# Altium schematic sheet Main_2.SchDoc
size 379 x 180 mm; SheetNumber: 5; SheetTotal: 12
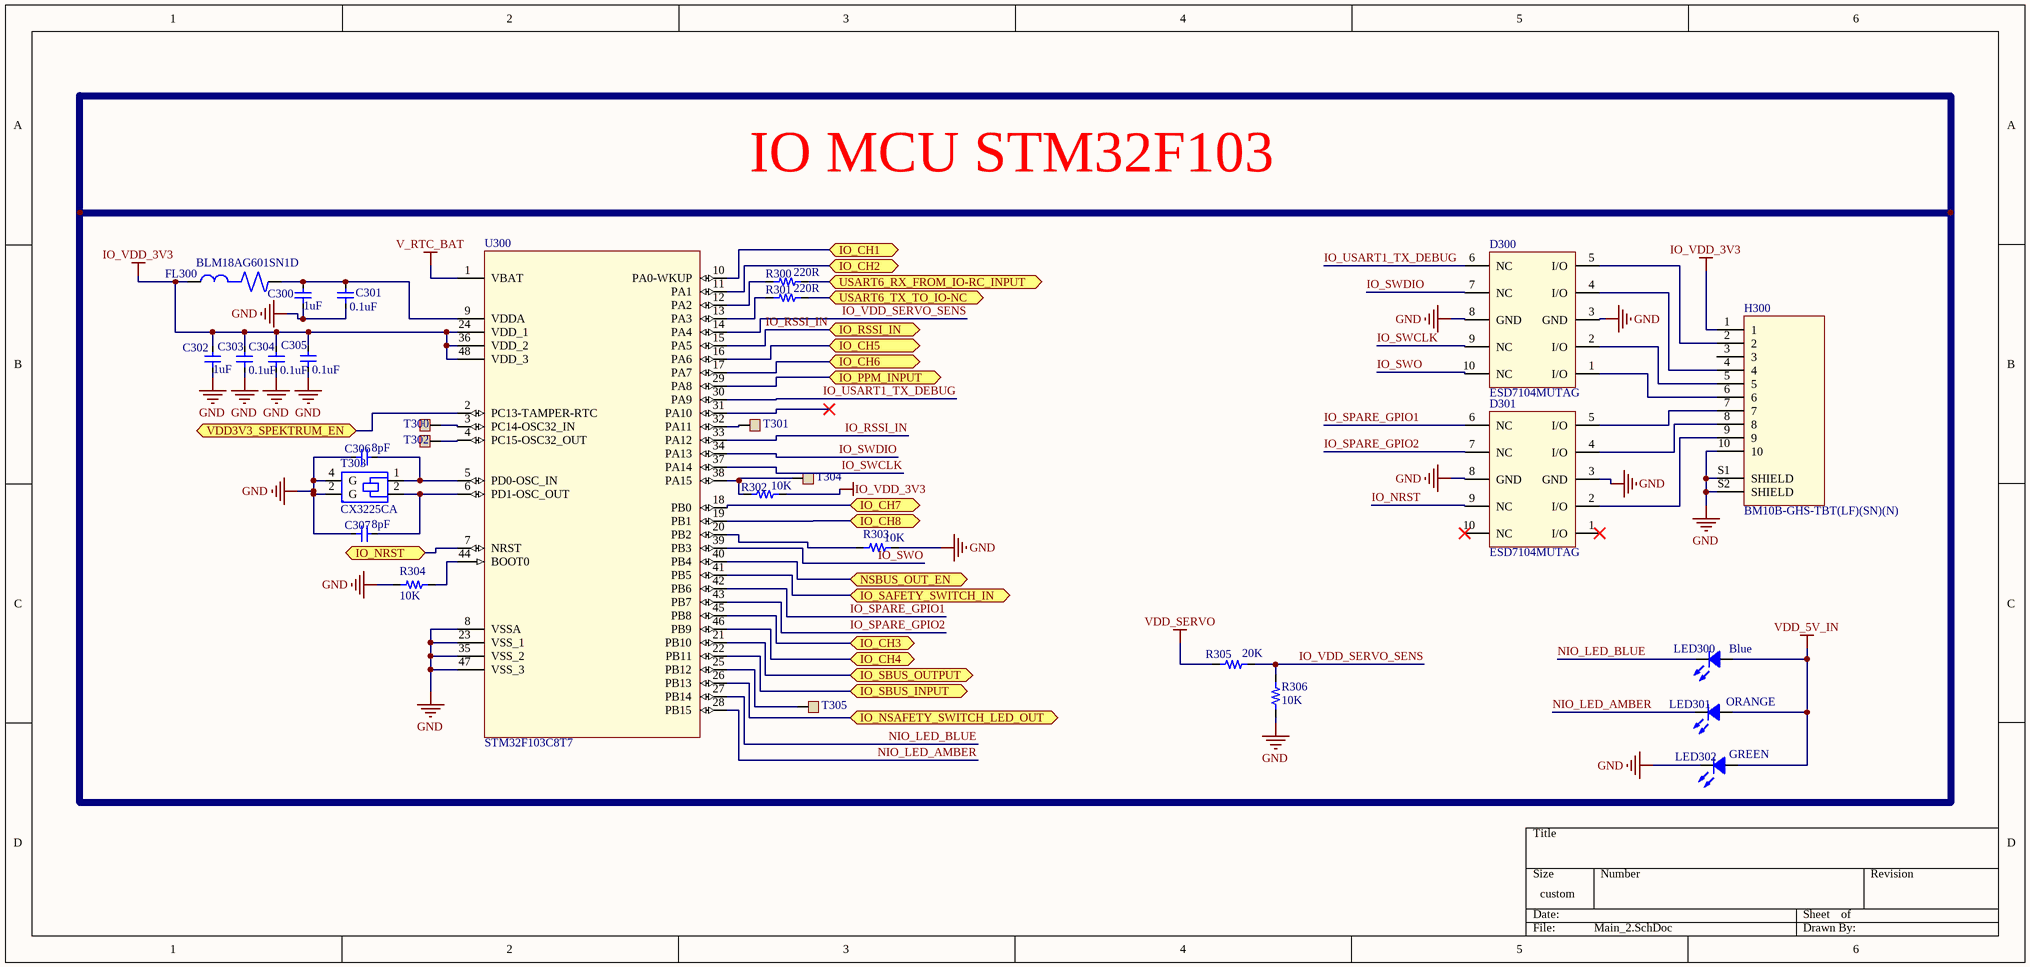
[diagram p0: Main_2.SchDoc]

## Parts
C300  1uF  [C0603]
C301  0.1uF  [C0603]
C302  1uF  [C0603]
C303  0.1uF  [C0603]
C304  0.1uF  [C0603]
C305  0.1uF  [C0603]
C306  8pF  [C0603]
C307  8pF  [C0603]
D300  ESD7104MUTAG  [UDFN10 2.5x1, 0.5P]
D301  ESD7104MUTAG  [UDFN10 2.5x1, 0.5P]
FL300  BLM18AG601SN1D  [BEADC1608X95N]
H300  BM10B-GHS-TBT(LF)(SN)(N)  [BM10B-GHS-TBT(LF)(SN)(N)]
LED300  Blue  [LED_0603_BLUE]
LED301  ORANGE  [LED_ORANGE_0603]
LED302  GREEN  [LED_GREEN_0603]
R300  220R  [R0402]
R301  220R  [R0402]
R302  10K  [R0402]
R303  10K  [R0402]
R304  10K  [R0402]
R305  20K  [R0402]
R306  10K  [R0402]
T300  TP  [TP_1.2]  (value not drawn)
T301  TP  [TP_1.2]  (value not drawn)
T302  TP  [TP_1.2]  (value not drawn)
T303  CX3225CA  [CX3225CA24000D0HSSCC]
T304  TP  [TP_1.2]  (value not drawn)
T305  TP  [TP_1.2]  (value not drawn)
U300  STM32F103C8T7  [48-LQFP]

## Ports
IO_CH1 (bidir), IO_CH2 (bidir), IO_CH3 (bidir), IO_CH4 (bidir), IO_CH5 (bidir), IO_CH6 (bidir), IO_CH7 (bidir), IO_CH8 (bidir), IO_NRST (bidir), IO_NSAFETY_SWITCH_LED_OUT (bidir), IO_PPM_INPUT (bidir), IO_RSSI_IN (bidir), IO_SAFETY_SWITCH_IN (bidir), IO_SBUS_INPUT (bidir), IO_SBUS_OUTPUT (bidir), NSBUS_OUT_EN (bidir), USART6_RX_FROM_IO-RC_INPUT (bidir), USART6_TX_TO_IO-NC (bidir), VDD3V3_SPEKTRUM_EN (bidir)

## Nets
GND: C300.1 C301.1 C302.1 C303.1 C304.1 C305.1 C306.1 C307.1 D300.3(GND) D300.8(GND) D301.3(GND) D301.8(GND) H300.10 H300.S1(SHIELD) H300.S2(SHIELD) LED302.2 R303.2 R304.1 R306.1 T303.2(G) T303.4(G) U300.8(VSSA) U300.23(VSS_1) U300.35(VSS_2) U300.47(VSS_3)
IO_VDD_3V3: C302.2 C303.2 C304.2 C305.2 FL300.1 H300.1 R302.2 U300.24(VDD_1) U300.36(VDD_2) U300.48(VDD_3)
V_RTC_BAT: U300.1(VBAT)
VDD_5V_IN: LED300.1 LED301.1 LED302.1
VDD_SERVO: R305.1
IO_CH1: U300.10(PA0-WKUP) ; port IO_CH1
IO_CH2: U300.11(PA1) ; port IO_CH2
IO_CH3: U300.45(PB8) ; port IO_CH3
IO_CH4: U300.46(PB9) ; port IO_CH4
IO_CH5: U300.16(PA6) ; port IO_CH5
IO_CH6: U300.17(PA7) ; port IO_CH6
IO_CH7: U300.18(PB0) ; port IO_CH7
IO_CH8: U300.19(PB1) ; port IO_CH8
IO_NRST: U300.7(NRST) ; port IO_NRST
IO_NRST: D301.9(NC)  [a separate net that carries the same name]
IO_NSAFETY_SWITCH_LED_OUT: U300.26(PB13) ; port IO_NSAFETY_SWITCH_LED_OUT
IO_PPM_INPUT: U300.29(PA8) ; port IO_PPM_INPUT
IO_RSSI_IN: U300.15(PA5) U300.33(PA12) ; port IO_RSSI_IN
IO_SAFETY_SWITCH_IN: U300.41(PB5) ; port IO_SAFETY_SWITCH_IN
IO_SBUS_INPUT: U300.22(PB11) ; port IO_SBUS_INPUT
IO_SBUS_OUTPUT: U300.21(PB10) ; port IO_SBUS_OUTPUT
IO_SPARE_GPIO1: D301.6(NC) U300.42(PB6)
IO_SPARE_GPIO2: D301.7(NC) U300.43(PB7)
IO_SWCLK: D300.9(NC) U300.37(PA14)
IO_SWDIO: D300.7(NC) U300.34(PA13)
IO_SWO: D300.10(NC) U300.39(PB3)
IO_USART1_TX_DEBUG: D300.6(NC) U300.30(PA9)
IO_VDD_SERVO_SENS: R305.2 R306.2 U300.14(PA4)
NIO_LED_AMBER: LED301.2 U300.28(PB15)
NIO_LED_BLUE: LED300.2 U300.27(PB14)
NSBUS_OUT_EN: U300.40(PB4) ; port NSBUS_OUT_EN
USART6_RX_FROM_IO-RC_INPUT: R300.2 ; port USART6_RX_FROM_IO-RC_INPUT
USART6_TX_TO_IO-NC: R301.2 ; port USART6_TX_TO_IO-NC
VDD3V3_SPEKTRUM_EN: U300.2(PC13-TAMPER-RTC) ; port VDD3V3_SPEKTRUM_EN
NetC300_2: C300.2 C301.2 FL300.2 U300.9(VDDA)
NetC306_2: C306.2 T303.1 U300.5(PD0-OSC_IN)
NetC307_2: C307.2 T303.2 U300.6(PD1-OSC_OUT)
NetD300_1: D300.1(I/O) H300.6
NetD300_2: D300.2(I/O) H300.5
NetD300_4: D300.4(I/O) H300.4
NetD300_5: D300.5(I/O) H300.2
NetD301_2: D301.2(I/O) H300.9
NetD301_4: D301.4(I/O) H300.8
NetD301_5: D301.5(I/O) H300.7
NetR300_1: R300.1 U300.12(PA2)
NetR301_1: R301.1 U300.13(PA3)
NetR302_1: R302.1 T304.1 U300.38(PA15)
NetR303_1: R303.1 U300.20(PB2)
NetR304_2: R304.2 U300.44(BOOT0)
NetT300_1: T300.1 U300.3(PC14-OSC32_IN)
NetT301_1: T301.1 U300.32(PA11)
NetT302_1: T302.1 U300.4(PC15-OSC32_OUT)
NetT305_1: T305.1 U300.25(PB12)

Not connected (* = marked no-connect by the designer): D301 1(I/O)* 10(NC)*; H300 3; U300 31(PA10)*

## Notes on the sheet
- IO MCU STM32F103

## Library data of the parts
C300 C302 = CC0603JRX7R6BB105: CAP CER 1UF 10V X7R 0603
C301 C303-C305 = CC0603KRX7R8BB104: CAP CER 0.1UF 25V X7R 0603
C306 C307 = CC0603DRNPO9BN8R0: 8 pF ±0.5pF 50V Ceramic Capacitor C0G, NP0 0603 (1608 Metric)
D300 D301 = ESD7104MUTAG: TVS DIODE 5VWM 10VC 10UDFN
FL300 = BLM18AG601SN1D: FERRITE BEAD 600 OHM 0603 1LN
H300 = BM10B-GHS-TBT(LF)(SN)(N): Connector Header Surface Mount 10 position 0.049" (1.25mm)
LED300 = LTST-C190TBKT: LED BLUE CLEAR CHIP SMD
LED301 = LTST-C190KFKT: Orange 605nm LED Indication - Discrete 2V 0603 (1608 Metric)
LED302 = LTST-C190GKT: Green 569nm LED Indication - Discrete 2.1V 0603 (1608 Metric)
R300 R301 = RC0402FR-07220RL: RES 220 OHM 1% 1/16W 0402
R302-R304 R306 = RC1005F103CS: RES SMD 10K OHM 1% 1/16W 0402
R305 = RC0402FR-0720KL: RES 20K OHM 1% 1/16W 0402
T300-T302 T304 T305 = Test point: 1.2mmx1.2mm
T303 = CX3225CA24000D0HSSCC: CRYSTAL 24.0000MHZ 8PF SMD
U300 = STM32F103C8T7: ARM® Cortex®-M3 STM32F1 Microcontroller IC 32-Bit Single-Core 72MHz 64KB (64K x 8) FLASH 48-LQFP (7x7)